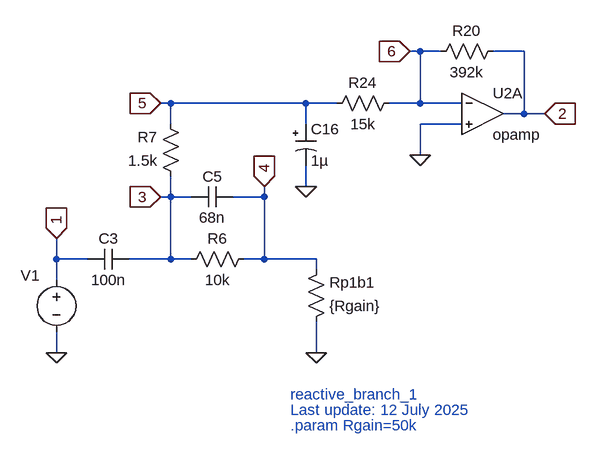
[diagram p0: schematic reactive_branch_1.asc]
reactive_branch_1.asc, the LTspice schematic file:
Version 4
SHEET 1 4496 5064
WIRE 352 2240 336 2240
WIRE 384 2240 352 2240
WIRE 512 2240 464 2240
WIRE -32 2320 -48 2320
WIRE 176 2320 -32 2320
WIRE 224 2320 176 2320
WIRE 352 2320 352 2240
WIRE 352 2320 304 2320
WIRE 416 2320 352 2320
WIRE 512 2336 512 2240
WIRE 512 2336 480 2336
WIRE 544 2336 512 2336
WIRE -32 2352 -32 2320
WIRE 176 2352 176 2320
WIRE 416 2352 352 2352
WIRE 352 2400 352 2352
WIRE 176 2448 176 2416
WIRE -32 2464 -32 2432
WIRE -32 2464 -48 2464
WIRE 0 2464 -32 2464
WIRE 112 2464 112 2448
WIRE 112 2464 64 2464
WIRE -208 2560 -208 2528
WIRE -160 2560 -208 2560
WIRE -32 2560 -32 2464
WIRE -32 2560 -96 2560
WIRE 0 2560 -32 2560
WIRE 112 2560 112 2464
WIRE 112 2560 80 2560
WIRE 192 2560 112 2560
WIRE 192 2576 192 2560
WIRE -208 2592 -208 2560
WIRE -208 2704 -208 2672
WIRE 192 2704 192 2656
FLAG -208 2528 1
IOPIN -208 2528 In
FLAG 176 2448 0
FLAG -208 2704 0
FLAG -48 2464 3
IOPIN -48 2464 In
FLAG -48 2320 5
IOPIN -48 2320 In
FLAG 112 2448 4
IOPIN 112 2448 In
FLAG 192 2704 0
FLAG 544 2336 2
IOPIN 544 2336 In
FLAG 352 2400 0
FLAG 336 2240 6
IOPIN 336 2240 In
SYMBOL voltage -208 2576 R0
WINDOW 0 -55 9 Left 2
WINDOW 39 0 0 Left 0
WINDOW 3 -128 54 Invisible 2
SYMATTR InstName V1
SYMATTR Value 1
SYMATTR Value2 AC 0 0
SYMBOL cap -96 2544 R90
WINDOW 0 0 32 VBottom 2
WINDOW 3 32 32 VTop 2
SYMATTR InstName C3
SYMATTR Value 100n
SYMBOL res 96 2544 R90
WINDOW 0 0 56 VBottom 2
WINDOW 3 32 56 VTop 2
SYMATTR InstName R6
SYMATTR Value 10k
SYMBOL cap 64 2448 R90
WINDOW 0 0 32 VBottom 2
WINDOW 3 32 32 VTop 2
SYMATTR InstName C5
SYMATTR Value 68n
SYMBOL res -16 2448 R180
WINDOW 0 36 76 Left 2
WINDOW 3 36 40 Left 2
SYMATTR InstName R7
SYMATTR Value 1.5k
SYMBOL res 320 2304 R90
WINDOW 0 0 56 VBottom 2
WINDOW 3 32 56 VTop 2
SYMATTR InstName R24
SYMATTR Value 15k
SYMBOL polcap 160 2352 R0
SYMATTR InstName C16
SYMATTR Value 1µ
SYMBOL res 176 2672 M180
WINDOW 0 36 76 Left 2
WINDOW 3 36 40 Left 2
SYMATTR InstName Rp1b1
SYMATTR Value {Rgain}
SYMBOL OpAmps\\opamp 448 2272 R0
SYMATTR InstName U2A
SYMBOL res 480 2224 R90
WINDOW 0 0 56 VBottom 2
WINDOW 3 32 56 VTop 2
SYMATTR InstName R20
SYMATTR Value 392k
TEXT 152 2816 Left 2 ;.param Rgain=50k
TEXT 152 2768 Left 2 ;reactive_branch_1
TEXT 152 2792 Left 2 ;Last update: 12 July 2025

The netlist it stands for:
* reactive_branch_1.asc
V1 1 0 1 AC 0 0
C3 3 1 100n
R6 4 3 10k
C5 4 3 68n
R7 3 5 1.5k
R24 6 5 15k
C16 5 0 1µ
Rp1b1 0 4 {Rgain}
XU2A 6 0 2 opamp Aol=100K GBW=10Meg  ; pins invin noninvin out
R20 2 6 392k
* .param Rgain=50k
* reactive_branch_1
* Last update: 12 July 2025
.backanno
.end